# EAGLE design design (EAGLE 9.5.1)
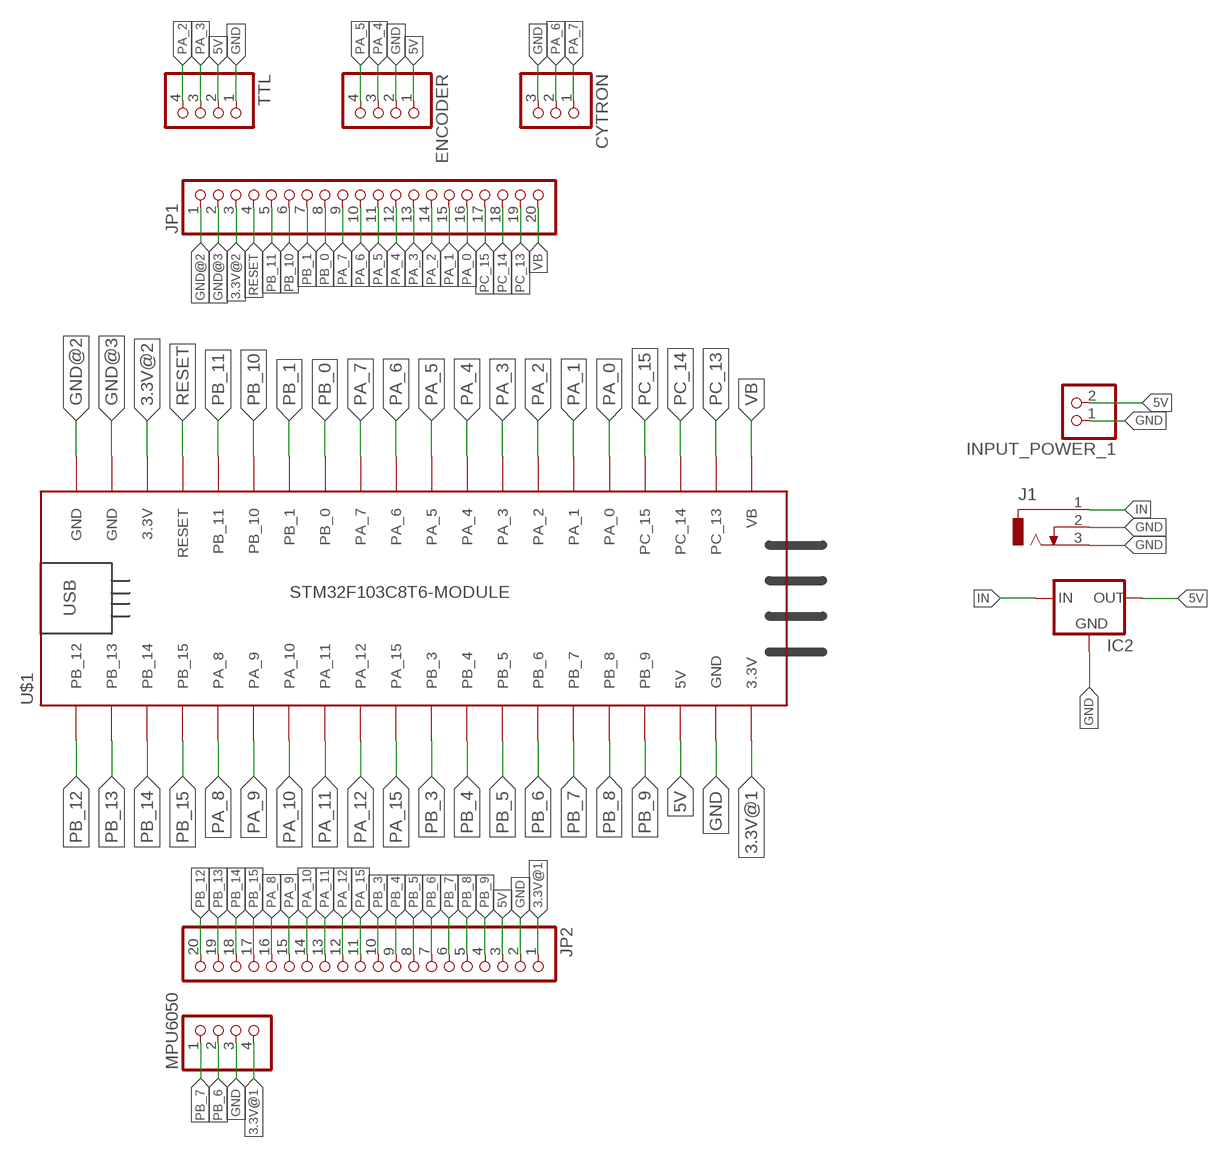
[diagram p0: schematic, sheet 1]

## Parts
CYTRON  PINHD-1X3  [1X03]
ENCODER  PINHD-1X4  [1X04]
IC2  78XXS  [78XXS]
INPUT_POWER_1  PINHD-1X2  [1X02]
J1  CON_JACK  [DCJ0303]
JP1  PINHD-1X20  [1X20]
JP2  PINHD-1X20  [1X20]
MPU6050  PINHD-1X4  [1X04]
TTL  PINHD-1X4  [1X04]
U$1  STM32F103C8T6-MODULE  [STM32F103C8T6-MODULE]

## Nets
3.3V@1: JP2.1 MPU6050.4 U$1.3.3V_1(3.3V)
3.3V@2: JP1.3 U$1.3.3V_2(3.3V)
5V: ENCODER.1 IC2.OUT INPUT_POWER_1.2 JP2.3 TTL.2 U$1.5V
GND: CYTRON.3 ENCODER.2 IC2.GND INPUT_POWER_1.1 J1.2 J1.3 JP2.2 MPU6050.3 TTL.1 U$1.GND_1(GND)
GND@2: JP1.1 U$1.GND_3(GND)
GND@3: JP1.2 U$1.GND_2(GND)
IN: IC2.IN J1.1
PA_0: JP1.16 U$1.PA_0
PA_1: JP1.15 U$1.PA_1
PA_2: JP1.14 TTL.4 U$1.PA_2
PA_3: JP1.13 TTL.3 U$1.PA_3
PA_4: ENCODER.3 JP1.12 U$1.PA_4
PA_5: ENCODER.4 JP1.11 U$1.PA_5
PA_6: CYTRON.2 JP1.10 U$1.PA_6
PA_7: CYTRON.1 JP1.9 U$1.PA_7
PA_8: JP2.16 U$1.PA_8
PA_9: JP2.15 U$1.PA_9
PA_10: JP2.14 U$1.PA_10
PA_11: JP2.13 U$1.PA_11
PA_12: JP2.12 U$1.PA_12
PA_15: JP2.11 U$1.PA_15
PB_0: JP1.8 U$1.PB_0
PB_1: JP1.7 U$1.PB_1
PB_3: JP2.10 U$1.PB_3
PB_4: JP2.9 U$1.PB_4
PB_5: JP2.8 U$1.PB_5
PB_6: JP2.7 MPU6050.2 U$1.PB_6
PB_7: JP2.6 MPU6050.1 U$1.PB_7
PB_8: JP2.5 U$1.PB_8
PB_9: JP2.4 U$1.PB_9
PB_10: JP1.6 U$1.PB_10
PB_11: JP1.5 U$1.PB_11
PB_12: JP2.20 U$1.PB_12
PB_13: JP2.19 U$1.PB_13
PB_14: JP2.18 U$1.PB_14
PB_15: JP2.17 U$1.PB_15
PC_13: JP1.19 U$1.PC_13
PC_14: JP1.18 U$1.PC_14
PC_15: JP1.17 U$1.PC_15
RESET: JP1.4 U$1.RESET
VB: JP1.20 U$1.VB

## Library data of the parts
CYTRON = MIA_LIBRARY-2-2-2:PINHD-1X3: PIN HEADER
ENCODER MPU6050 TTL = MIA_LIBRARY-2-2-2:PINHD-1X4: PIN HEADER
IC2 = MIA_LIBRARY-2-2-2:78XXS: VOLTAGE REGULATOR
INPUT_POWER_1 = MIA_LIBRARY-2-2-2:PINHD-1X2: PIN HEADER
J1 = MIA_LIBRARY-2-2-2:CON_JACK: DC POWER JACK Source: DCJ0303.pdf; OC_FARNELL: unknown; OC_NEWARK: unknown
JP1 JP2 = MIA_LIBRARY-2-2-2:PINHD-1X20: PIN HEADER
U$1 = MIA_LIBRARY-2-2-2:STM32F103C8T6-MODULE: STM32F103C8T6 module with ARM Cortex-3, 20kB SRAM, 64kB Flash, 72MHz

## Board
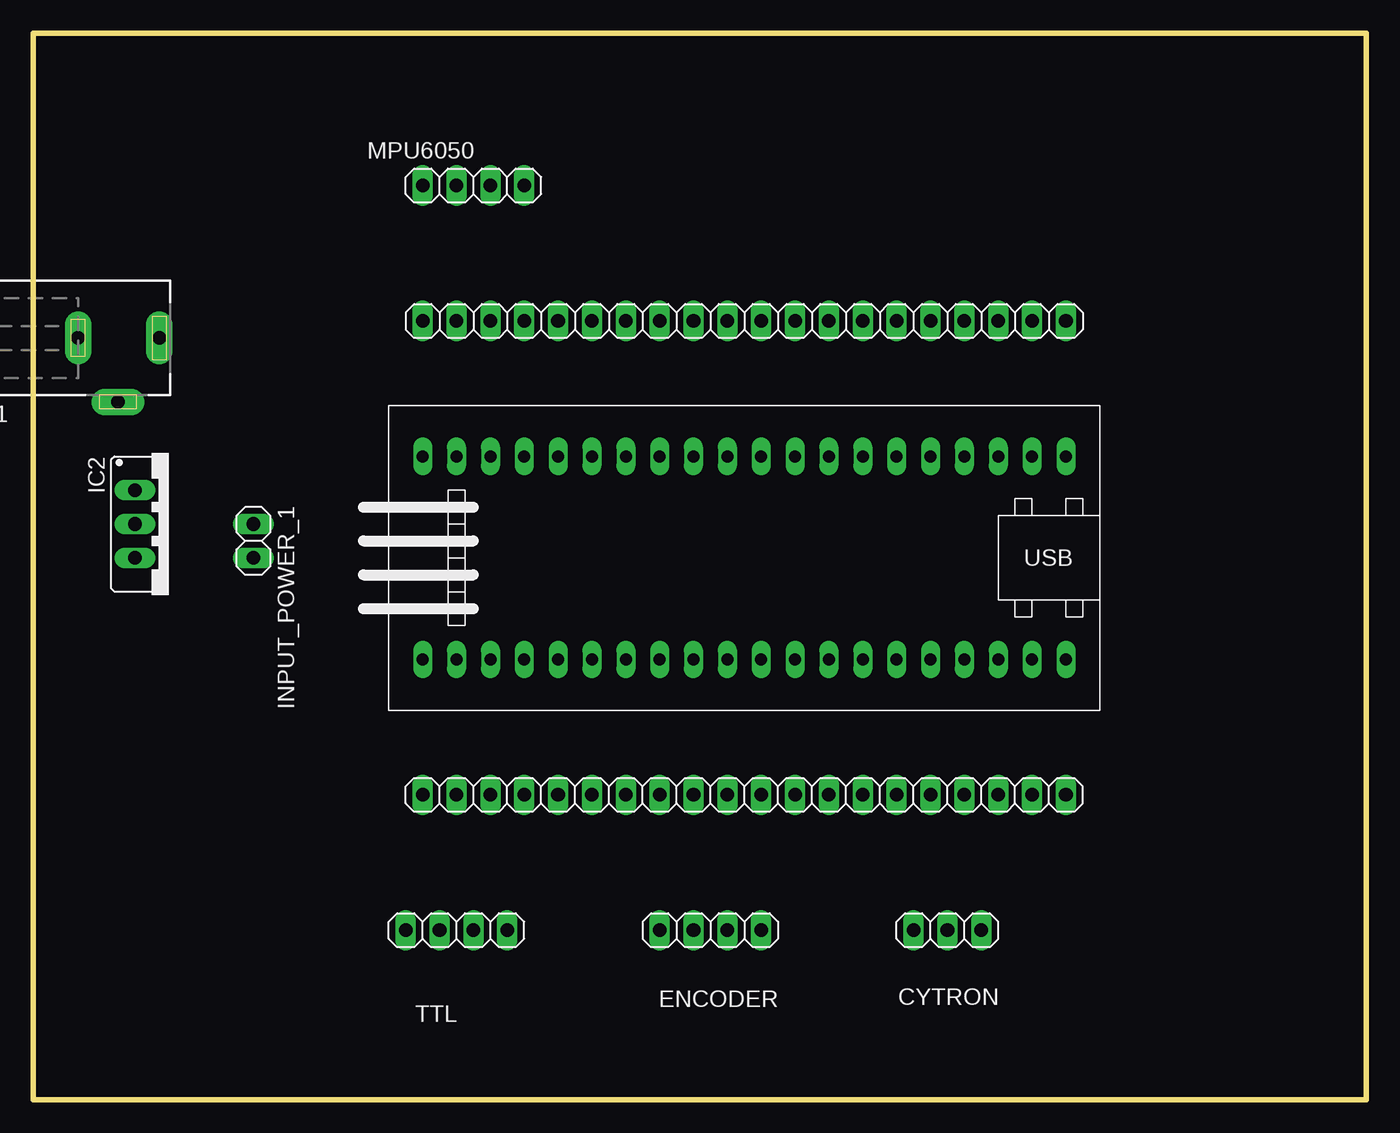
[diagram p1: board, top side]
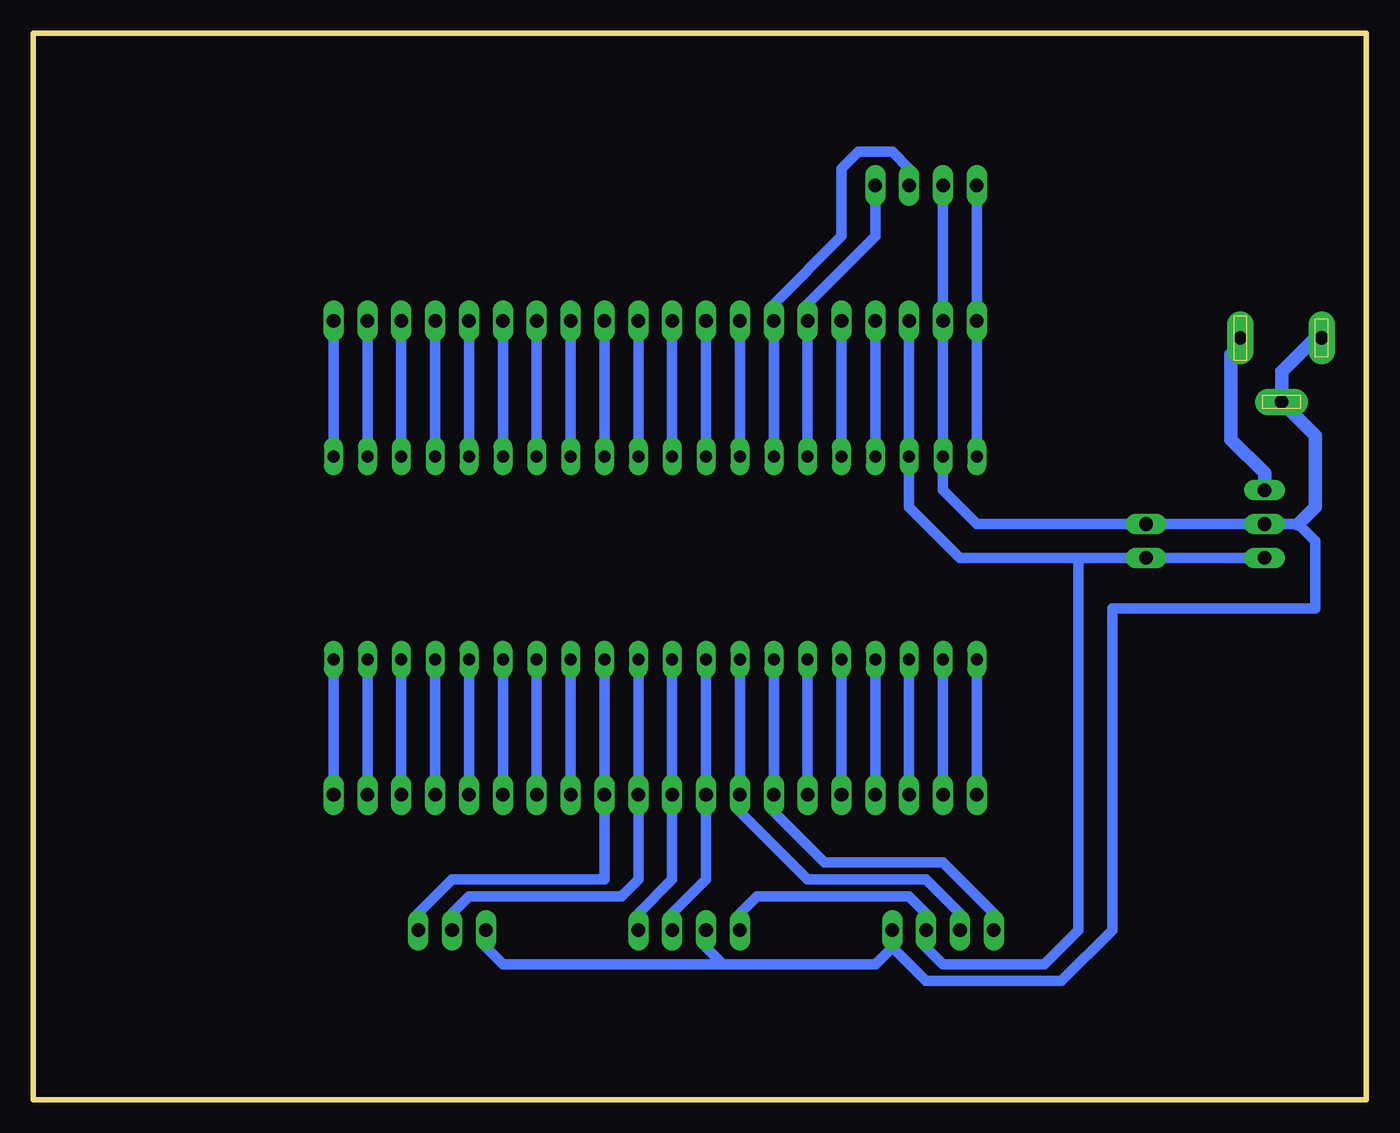
[diagram p2: board, bottom side, seen from below]

Size 100 x 80 mm. Coordinates in mm from the lower left corner, seen from the top.
Outline: 0,0 100,0 100,80 0,80 0,0
Copper layers (1*16): Top 0.035mm / dielectric 1.5mm / Bottom 0.035mm
Design rules "default": minimum track width 6mil, minimum drill 0.35mm, track to track 6mil, track to pad 6mil, pad to pad 6mil, via to via 6mil, smd to smd 6mil, copper to edge 40mil, drill to drill 6mil, minimum pad ring 10mil, minimum via ring 8mil, stop-mask expansion 4mil, vias tented up to drill 0mil, thermal gap 10mil

### Footprints (pad centres in the part's own frame; a part is rotated, then mirrored left to right if it is on the bottom)
1X03 = drill 1.016 long: 1 -2.54,0; 2 0,0; 3 2.54,0
1X04 = drill 1.016 long: 1 -3.81,0; 2 -1.27,0; 3 1.27,0; 4 3.81,0
78XXS = drill 1.016 long: GND 0,-2.54; IN -2.54,-2.54; OUT 2.54,-2.54
1X02 = drill 1.016 long: 1 -1.27,0; 2 1.27,0
DCJ0303 = drill 1 pad 2 long: 1 0,3.1; 2 4.8,0; 3 0,-3
1X20 = drill 1.016 long: 1 -24.13,0; 2 -21.59,0; 3 -19.05,0; 4 -16.51,0; 5 -13.97,0; 6 -11.43,0; 7 -8.89,0; 8 -6.35,0; 9 -3.81,0; 10 -1.27,0; 11 1.27,0; 12 3.81,0; 13 6.35,0; 14 8.89,0; 15 11.43,0; 16 13.97,0; 17 16.51,0; 18 19.05,0; 19 21.59,0; 20 24.13,0
STM32F103C8T6-MODULE = drill 0.9 long: 3.3V_1 25.4,-7.62; 3.3V_2 -17.78,7.62; 5V 20.32,-7.62; GND_1 22.86,-7.62; GND_2 -20.32,7.62; GND_3 -22.86,7.62; PA_0 15.24,7.62; PA_1 12.7,7.62; PA_2 10.16,7.62; PA_3 7.62,7.62; PA_4 5.08,7.62; PA_5 2.54,7.62; PA_6 0,7.62; PA_7 -2.54,7.62; PA_8 -12.7,-7.62; PA_9 -10.16,-7.62; PA_10 -7.62,-7.62; PA_11 -5.08,-7.62; PA_12 -2.54,-7.62; PA_15 0,-7.62; PB_0 -5.08,7.62; PB_1 -7.62,7.62; PB_3 2.54,-7.62; PB_4 5.08,-7.62; PB_5 7.62,-7.62; PB_6 10.16,-7.62; PB_7 12.7,-7.62; PB_8 15.24,-7.62; PB_9 17.78,-7.62; PB_10 -10.16,7.62; PB_11 -12.7,7.62; PB_12 -22.86,-7.62; PB_13 -20.32,-7.62; PB_14 -17.78,-7.62; PB_15 -15.24,-7.62; PC_13 22.86,7.62; PC_14 20.32,7.62; PC_15 17.78,7.62; RESET -15.24,7.62; VB 25.4,7.62

### Placement (x,y rotation side)
CYTRON  68.58,12.7 180 top
ENCODER  50.8,12.7 0 top
IC2  10.16,43.18 270 top
INPUT_POWER_1  16.51,41.91 270 top
J1  6.35,57.15 270 top
JP1  53.34,22.86 180 top
JP2  53.34,58.42 0 top
MPU6050  33.02,68.58 180 top
TTL  31.75,12.7 180 top
U$1  54.61,40.64 180 top

### Tracks (layer width: path | path; a pad name or v marks a point on that pad's centre or on a via)
3.3V@1
  Bottom 0.8: U$1.3.3V_1 JP2.1 MPU6050.4
3.3V@2
  Bottom 0.8: JP1.3 U$1.3.3V_2
5V
  Bottom 0.8: JP2.3 U$1.5V 34.29,44.45 30.48,40.64 21.59,40.64 | 21.59,40.64 INPUT_POWER_1.2 IC2.OUT | 21.59,40.64 21.59,12.7 24.13,10.16 31.75,10.16 33.02,11.43 TTL.2 33.02,13.97 34.29,15.24 45.72,15.24 46.99,13.97 ENCODER.1
GND
  Bottom 0.8: TTL.1 35.56,11.43 | 35.56,11.43 36.83,10.16 48.26,10.16 | 48.26,10.16 49.53,11.43 ENCODER.2 | CYTRON.3 66.04,11.43 64.77,10.16 48.26,10.16 | 35.56,11.43 33.02,8.89 22.86,8.89 19.05,12.7 19.05,36.83 3.81,36.83 3.81,41.91 5.08,43.18 IC2.GND INPUT_POWER_1.1 29.21,43.18 31.75,45.72 U$1.GND_1 JP2.2 MPU6050.3
  Bottom 1: J1.3 3.81,57.15 6.35,54.61 J1.2 3.81,49.81 3.81,44.45 5.08,43.18
GND@2
  Bottom 0.8: JP1.1 U$1.GND_3
GND@3
  Bottom 0.8: JP1.2 U$1.GND_2
IN
  Bottom 1: IC2.IN 7.62,46.99 10.16,49.53 10.16,55.88 9.45,56.59 J1.1
PA_0
  Bottom 0.8: JP1.16 U$1.PA_0
PA_1
  Bottom 0.8: JP1.15 U$1.PA_1
PA_2
  Bottom 0.8: U$1.PA_2 JP1.14 44.45,21.59 40.64,17.78 31.75,17.78 27.94,13.97 TTL.4
PA_3
  Bottom 0.8: U$1.PA_3 JP1.13 46.99,21.59 41.91,16.51 33.02,16.51 30.48,13.97 TTL.3
PA_4
  Bottom 0.8: U$1.PA_4 JP1.12 49.53,16.51 52.07,13.97 ENCODER.3
PA_5
  Bottom 0.8: U$1.PA_5 JP1.11 52.07,16.51 54.61,13.97 ENCODER.4
PA_6
  Bottom 0.8: U$1.PA_6 JP1.10 54.61,16.51 55.88,15.24 67.31,15.24 68.58,13.97 CYTRON.2
PA_7
  Bottom 0.8: U$1.PA_7 JP1.9 57.15,16.51 68.58,16.51 71.12,13.97 CYTRON.1
PA_8
  Bottom 0.8: U$1.PA_8 JP2.16
PA_9
  Bottom 0.8: U$1.PA_9 JP2.15
PA_10
  Bottom 0.8: U$1.PA_10 JP2.14
PA_11
  Bottom 0.8: U$1.PA_11 JP2.13
PA_12
  Bottom 0.8: U$1.PA_12 JP2.12
PA_15
  Bottom 0.8: U$1.PA_15 JP2.11
PB_0
  Bottom 0.8: JP1.8 U$1.PB_0
PB_1
  Bottom 0.8: JP1.7 U$1.PB_1
PB_3
  Bottom 0.8: U$1.PB_3 JP2.10
PB_4
  Bottom 0.8: U$1.PB_4 JP2.9
PB_5
  Bottom 0.8: U$1.PB_5 JP2.8
PB_6
  Bottom 0.8: U$1.PB_6 JP2.7 44.45,59.69 39.37,64.77 39.37,69.85 38.1,71.12 35.56,71.12 34.29,69.85 MPU6050.2
PB_7
  Bottom 0.8: U$1.PB_7 JP2.6 41.91,59.69 36.83,64.77 MPU6050.1
PB_8
  Bottom 0.8: U$1.PB_8 JP2.5
PB_9
  Bottom 0.8: U$1.PB_9 JP2.4
PB_10
  Bottom 0.8: JP1.6 U$1.PB_10
PB_11
  Bottom 0.8: JP1.5 U$1.PB_11
PB_12
  Bottom 0.8: U$1.PB_12 JP2.20
PB_13
  Bottom 0.8: U$1.PB_13 JP2.19
PB_14
  Bottom 0.8: U$1.PB_14 JP2.18
PB_15
  Bottom 0.8: U$1.PB_15 JP2.17
PC_13
  Bottom 0.8: JP1.19 U$1.PC_13
PC_14
  Bottom 0.8: JP1.18 U$1.PC_14
PC_15
  Bottom 0.8: JP1.17 U$1.PC_15
RESET
  Bottom 0.8: JP1.4 U$1.RESET
VB
  Bottom 0.8: JP1.20 U$1.VB